# EAGLE design imu_logger (EAGLE 9.6.2)

## Sheet 1 of 3
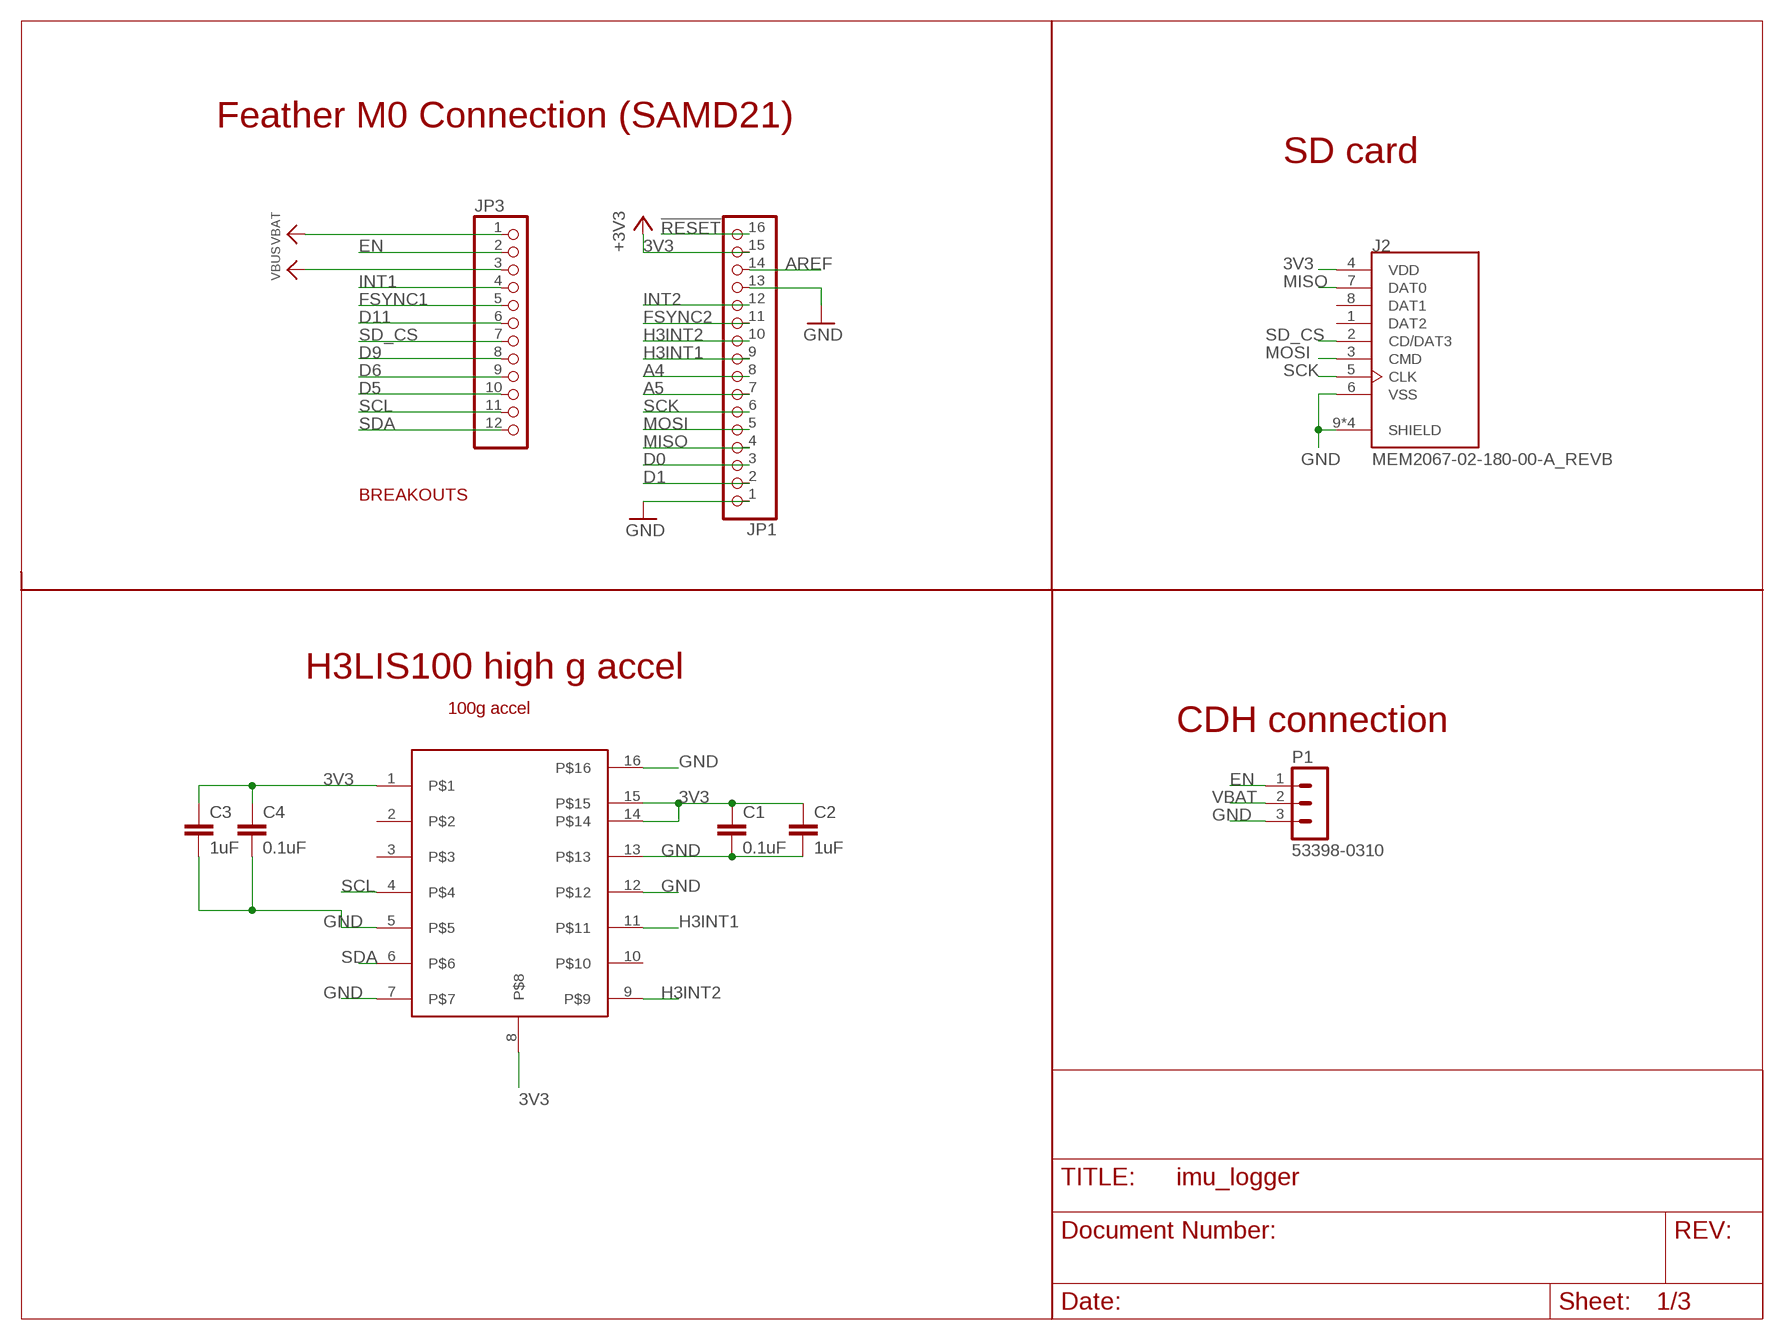
[diagram p0: schematic, sheet 1]

### Parts
C1  0.1uF  C-EUC0603  [C0603]
C2  1uF  C-EUC0603  [C0603]
C3  1uF  C-EUC0603  [C0603]
C4  0.1uF  C-EUC0603  [C0603]
J2  MEM2067-02-180-00-A_REVB  [GCT_MEM2067-02-180-00-A_REVB]
JP1  HEADER-1X16ROUND  [1X16_ROUND]
JP3  HEADER-1X12  [1X12_ROUND]
P1  53398-0310  [53398-0310]
U$1  H3LIS100DL  [XDCR_LIS3DHTR]

### Nets
3V3: C1.1 C2.1 C3.1 C4.1 J2.4(VDD) JP1.15 U$1.1 U$1.8 U$1.14 U$1.15 ; supply symbol labelled +3V3 ; also sheet 3
!RESET: JP1.16
A4: JP1.8
A5: JP1.7
AREF: JP1.14
D0: JP1.3
D1: JP1.2
D5: JP3.10
D6: JP3.9
D9: JP3.8
D11: JP3.6
EN: JP3.2 P1.1 ; also sheet 3
FSYNC1: JP3.5 ; also sheet 3
FSYNC2: JP1.11 ; also sheet 3
GND: C1.2 C2.2 C3.2 C4.2 J2.6(VSS) J2.9(SHIELD) J2.10(SHIELD) J2.11(SHIELD) J2.12(SHIELD) JP1.1 JP1.13 P1.3 U$1.5 U$1.7 U$1.12 U$1.13 U$1.16 ; also sheet 2,3
H3INT1: JP1.9 U$1.11
H3INT2: JP1.10 U$1.9
INT1: JP3.4 ; also sheet 3
INT2: JP1.12 ; also sheet 3
MISO: J2.7(DAT0) JP1.4
MOSI: J2.3(CMD) JP1.5
SCK: J2.5(CLK) JP1.6
SCL: JP3.11 U$1.4 ; also sheet 3
SD_CS: J2.2(CD/DAT3) JP3.7
SDA: JP3.12 U$1.6 ; also sheet 3
VBAT: JP3.1 P1.2 ; also sheet 3
VBUS: JP3.3
Unconnected: J2.1(DAT2) J2.8(DAT1) U$1.2 U$1.3 U$1.10

### Notes on the sheet
- Feather M0 Connection (SAMD21)
- SD card
- BREAKOUTS
- H3LIS100 high g accel
- 100g accel
- CDH connection

## Sheet 2 of 3
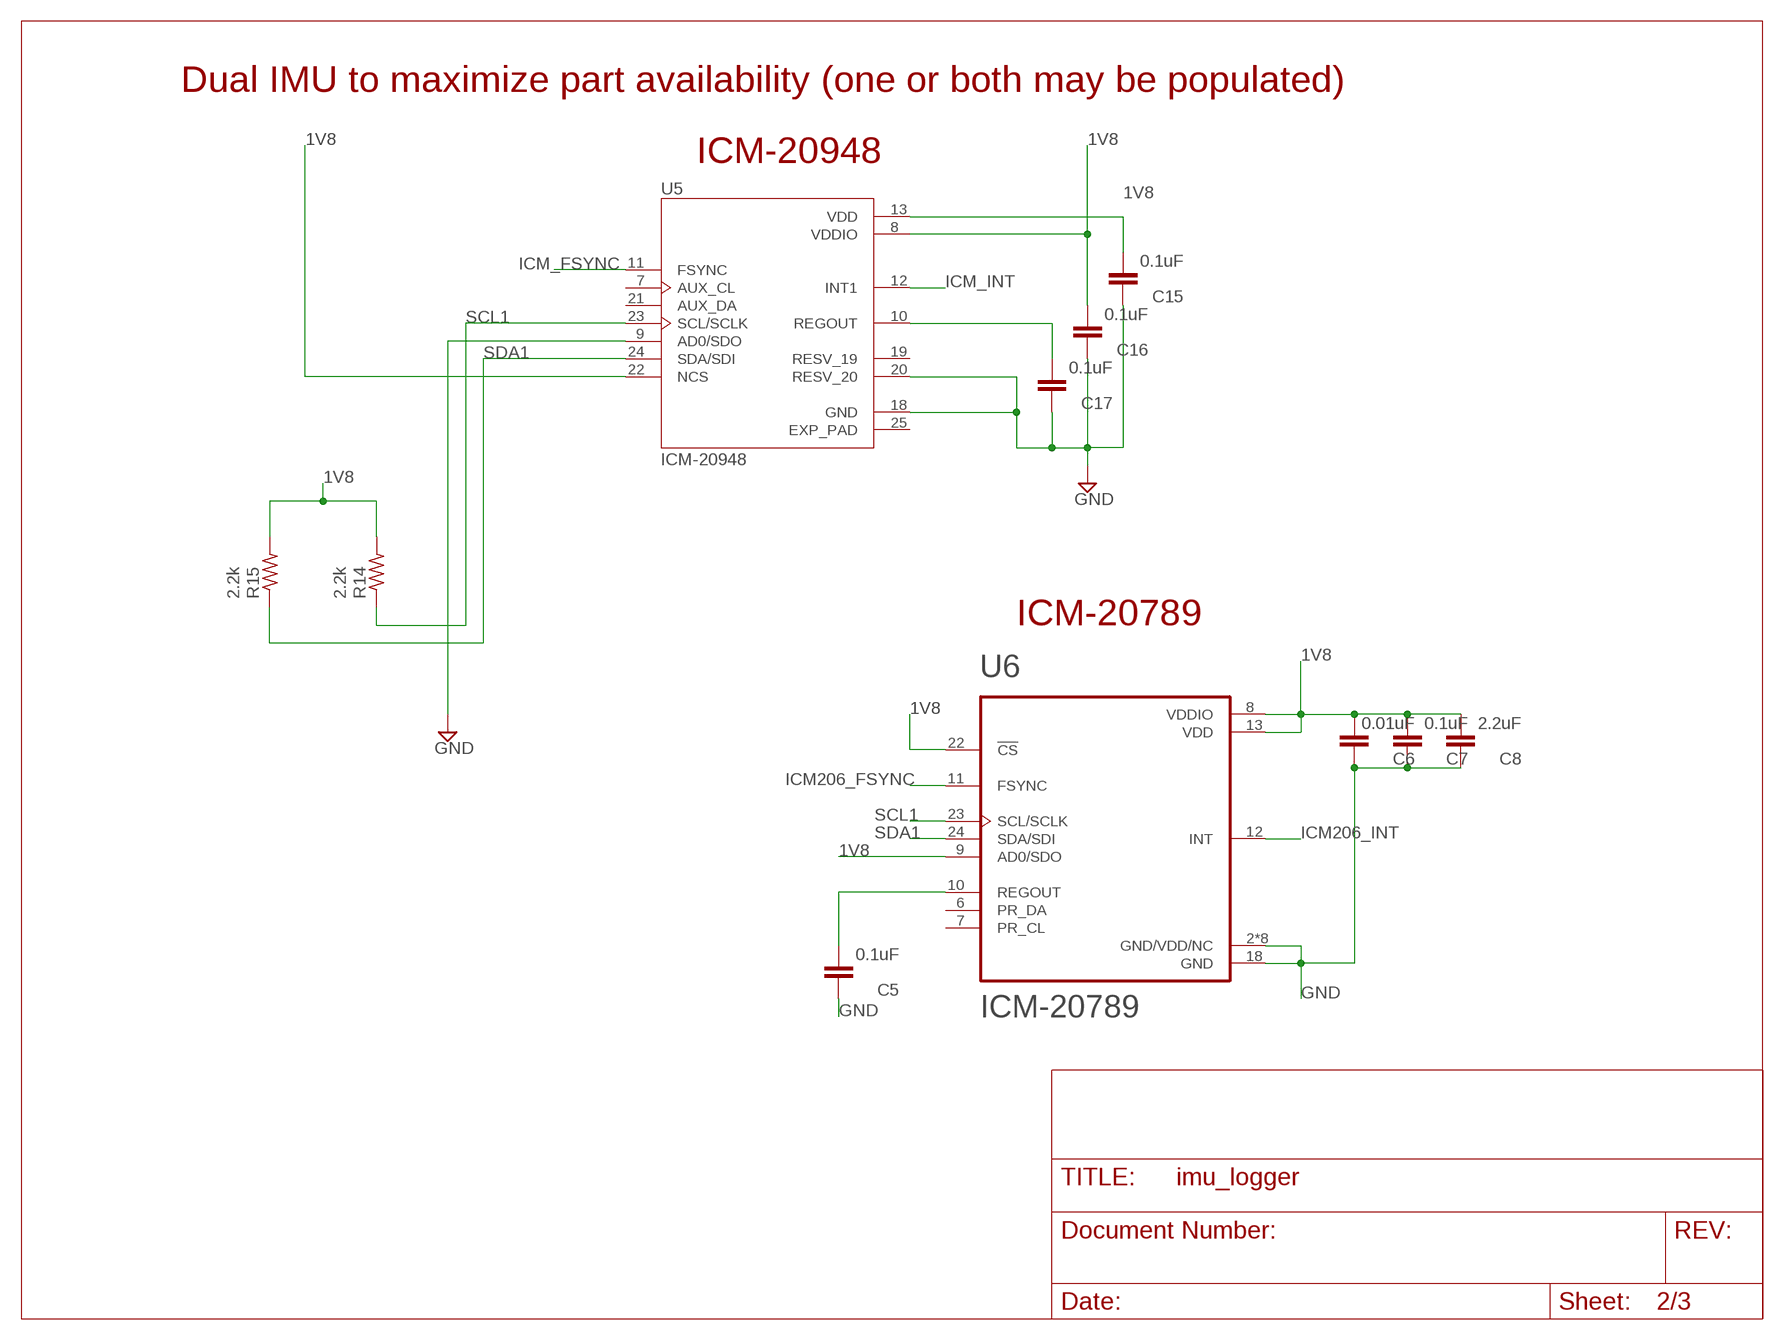
[diagram p1: schematic, sheet 2]

### Parts
C5  0.1uF  C-EUC0603  [C0603]
C6  0.01uF  C-EUC0603  [C0603]
C7  0.1uF  C-EUC0603  [C0603]
C8  2.2uF  C-EUC0603  [C0603]
C15  0.1uF  C-EUC0603  [C0603]
C16  0.1uF  C-EUC0603  [C0603]
C17  0.1uF  C-EUC0603  [C0603]
R14  2.2k  R-US_R0603  [R0603]
R15  2.2k  R-US_R0603  [R0603]
U5  ICM-20948  [QFN40P300X300X105-25N]
U6  ICM-20789  [PQFN50P400X400X146-24N]

### Nets
1V8: C6.2 C7.2 C8.2 C15.2 C16.2 R14.2 R15.2 U5.8(VDDIO) U5.13(VDD) U5.22(NCS) U6.8(VDDIO) U6.9(AD0/SDO) U6.13(VDD) U6.22(!CS) ; also sheet 3
GND: C5.1 C6.1 C7.1 C8.1 C15.1 C16.1 C17.1 U5.9(AD0/SDO) U5.18(GND) U5.20(RESV_20) U6.2(GND/VDD/NC) U6.3(GND/VDD/NC) U6.4(GND/VDD/NC) U6.5(GND/VDD/NC) U6.14(GND/VDD/NC) U6.15(GND/VDD/NC) U6.16(GND/VDD/NC) U6.17(GND/VDD/NC) U6.18(GND) ; also sheet 1,3
ICM206_FSYNC: U6.11(FSYNC) ; also sheet 3
ICM206_INT: U6.12(INT) ; also sheet 3
ICM_FSYNC: U5.11(FSYNC) ; also sheet 3
ICM_INT: U5.12(INT1) ; also sheet 3
N$4: C5.2 U6.10(REGOUT)
N$15: C17.2 U5.10(REGOUT)
SCL1: R14.1 U5.23(SCL/SCLK) U6.23(SCL/SCLK) ; also sheet 3
SDA1: R15.1 U5.24(SDA/SDI) U6.24(SDA/SDI) ; also sheet 3
Unconnected: U5.7(AUX_CL) U5.19(RESV_19) U5.21(AUX_DA) U6.6(PR_DA) U6.7(PR_CL)

### Notes on the sheet
- Dual IMU to maximize part availability (one or both may be populated)
- ICM-20948
- ICM-20789

## Sheet 3 of 3
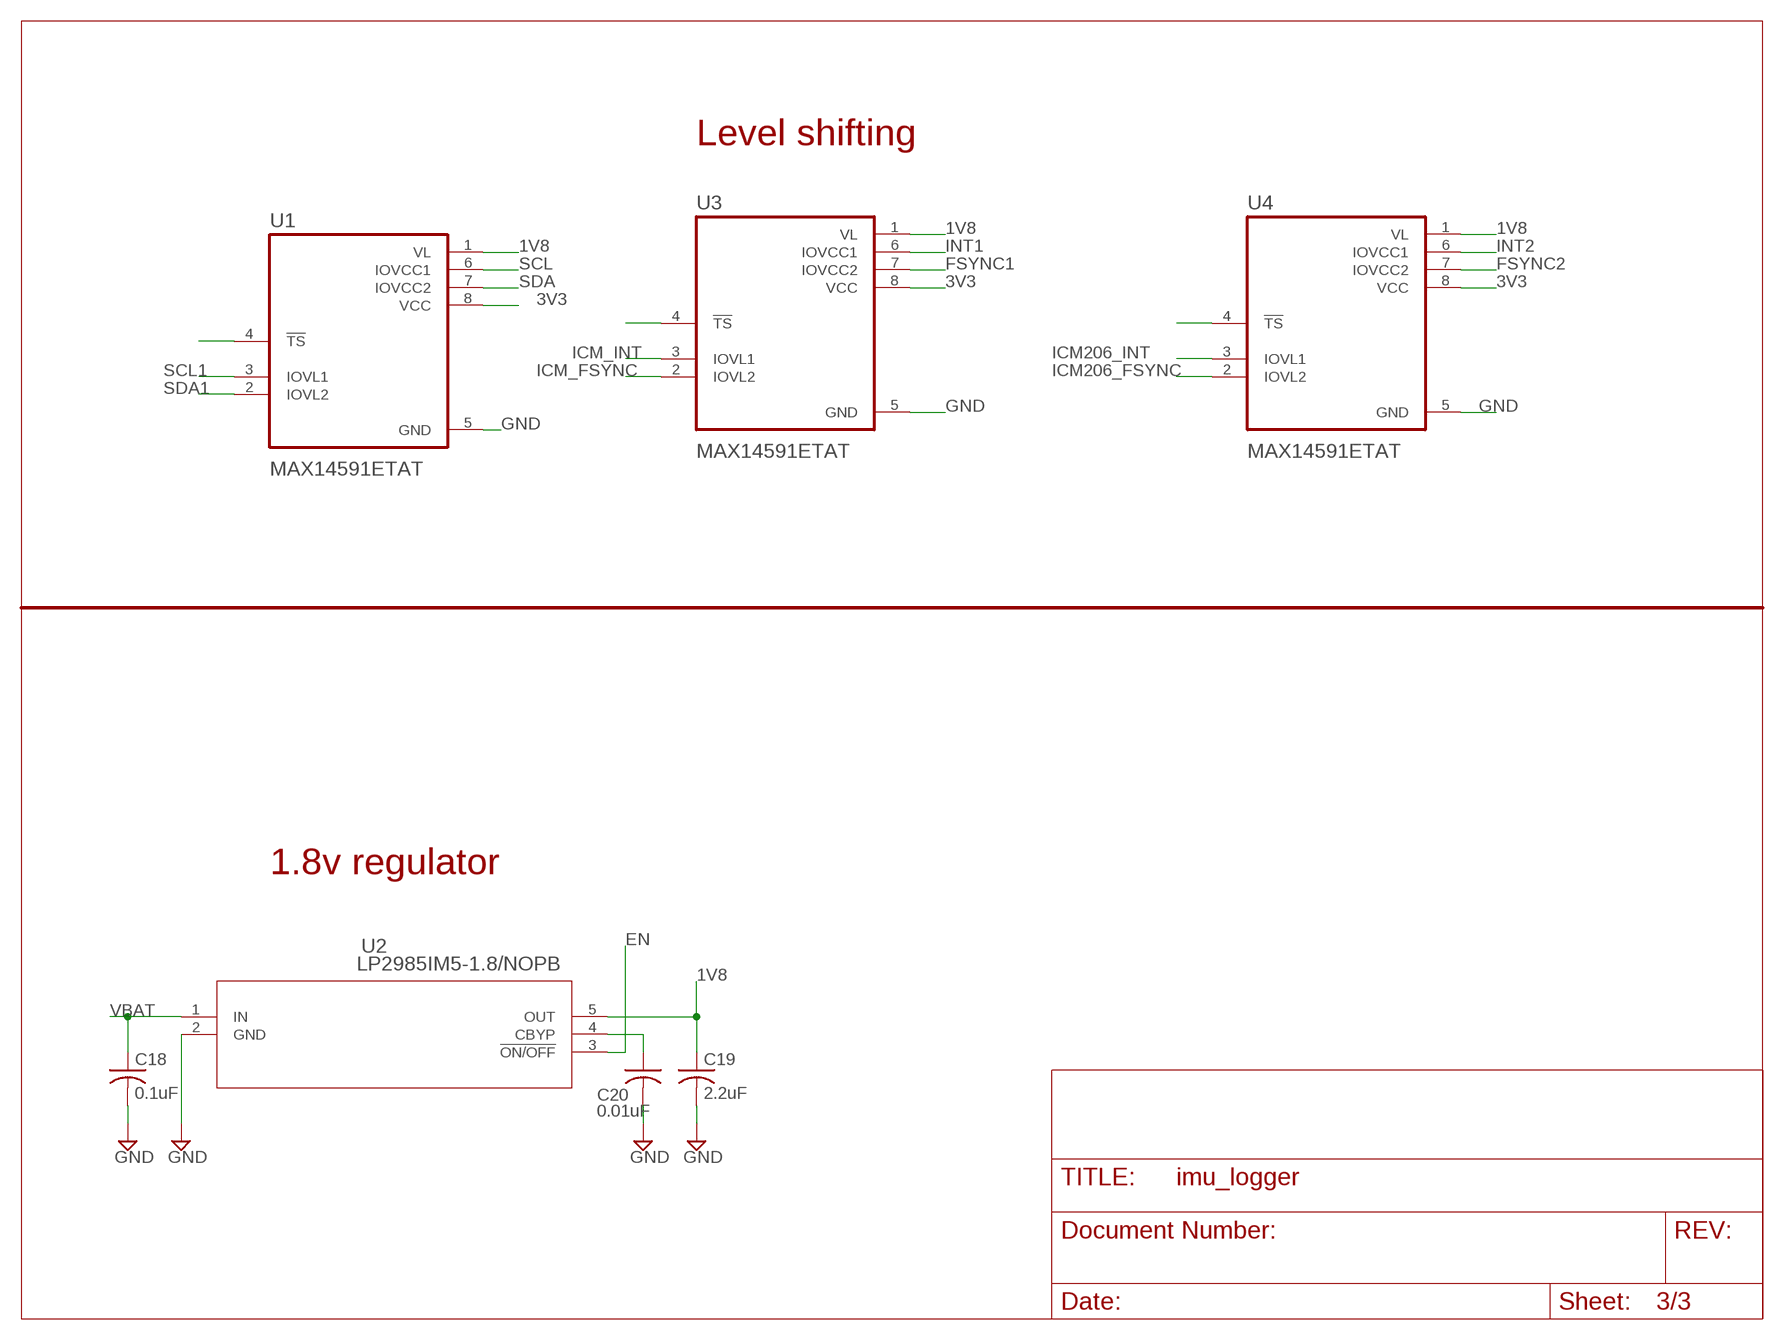
[diagram p2: schematic, sheet 3]

### Parts
C18  0.1uF  C-USC0603  [C0603]
C19  2.2uF  C-USC0603  [C0603]
C20  0.01uF  C-USC0603  [C0603]
U1  MAX14591ETAT  [SON50P200X200X80-8N]
U2  LP2985IM5-1.8/NOPB  [MF05A]
U3  MAX14591ETAT  [SON50P200X200X80-8N]
U4  MAX14591ETAT  [SON50P200X200X80-8N]

### Nets
1V8: C19.1 U1.1(VL) U2.5(OUT) U3.1(VL) U4.1(VL) ; also sheet 2
3V3: U1.8(VCC) U3.8(VCC) U4.8(VCC) ; also sheet 1
EN: U2.3(!ON/OFF) ; also sheet 1
FSYNC1: U3.7(IOVCC2) ; also sheet 1
FSYNC2: U4.7(IOVCC2) ; also sheet 1
GND: C18.2 C19.2 C20.2 U1.5(GND) U2.2(GND) U3.5(GND) U4.5(GND) ; also sheet 1,2
ICM206_FSYNC: U4.2(IOVL2) ; also sheet 2
ICM206_INT: U4.3(IOVL1) ; also sheet 2
ICM_FSYNC: U3.2(IOVL2) ; also sheet 2
ICM_INT: U3.3(IOVL1) ; also sheet 2
INT1: U3.6(IOVCC1) ; also sheet 1
INT2: U4.6(IOVCC1) ; also sheet 1
N$3: U4.4(!TS)
N$8: U1.4(!TS)
N$12: C20.1 U2.4(CBYP)
N$16: U3.4(!TS)
SCL: U1.6(IOVCC1) ; also sheet 1
SCL1: U1.3(IOVL1) ; also sheet 2
SDA: U1.7(IOVCC2) ; also sheet 1
SDA1: U1.2(IOVL2) ; also sheet 2
VBAT: C18.1 U2.1(IN) ; also sheet 1

### Notes on the sheet
- Level shifting
- 1.8v regulator

## Power pins joined to a net without a drawn wire
EXP_PAD: U5.25(EXP_PAD)

## Library data of the parts
C1-C8 C15-C17 = rcl:C-EU: CAPACITOR, European symbol; SPICEPREFIX: C
C18-C20 = rcl:C-US: CAPACITOR, American symbol; SPICEPREFIX: C
J2 = MEM20267:MEM2067-02-180-00-A_REVB: Micro SD Memory Card ConnectorSMT, Hinged, 1.80mm Profile Check prices <https://pricing.snapeda.com/parts/MEM2067-02-180-00-A/Global%20Connector%20Technology/view-part?ref=eda>; AVAILABILITY: In Stock; DESCRIPTION: 8 Position Card Connector microSD Surface Mount, Right Angle Gold; MF: Global Connector Technology; MP: MEM2067-02-180-00-A; PACKAGE: None; PRICE: None; PURCHASE-URL: https://pricing.snapeda.com/search/part/MEM2067-02-180-00-A/?ref=eda
JP1 = microbuilder:HEADER-1X16: PIN HEADER
JP3 = microbuilder:HEADER-1X12
P1 = con-molex-picoblade:53398-0310: HEADER
R14 R15 = rcl:R-US_: RESISTOR, American symbol; SPICEPREFIX: R
U1 U3 U4 = MAX14591ETAT:MAX14591ETAT; DESCRIPTION: Voltage Level Translator Bidirectional 1 Circuit 2 Channel 16Mbps 8-TDFN (2x2); DIGI-KEY_PART_NUMBER: MAX14591ETA+TCT-ND; MF: Maxim Integrated; MP: MAX14591ETA+T; PACKAGE: TDFN-8 Maxim; PURCHASE-URL: https://pricing.snapeda.com/search/part/MAX14591ETA+T/?ref=eda
U2 = gsynth:LP2985IM5-1.8/NOPB; MANUFACTURER_PART_NUMBER: LP2985IM51.8NOPB; VENDOR: Texas Instruments
U5 = ICM-20948:ICM-20948: Axis=3 Axis Gyro+3 Axis Accel+Compass. Pin For Pin With m; DESCRIPTION: 9 Axis=3 Axis Gyro+3 Axis Accel+Compass. Pin For Pin With m; DIGI-KEY_PART_NUMBER: 1428-1123-1-ND; DIGI-KEY_PURCHASE_URL: https://www.digikey.com/product-detail/en/tdk-invensense/ICM-20948/1428-1123-1-ND/7062698?utm_source=snapeda&utm_medium=aggregator&utm_campaign=symbol; MF: TDK InvenSense; MP: ICM-20948; PACKAGE: QFN-24 InvenSense
U6 = ICM-20789:ICM-20789: MOTION SENSOR IC; DESCRIPTION: Sensor I²C Output; DIGI-KEY_PART_NUMBER: 1428-1133-1-ND; MF: TDK InvenSense; MP: ICM-20789; PACKAGE: PQFN-24 TDK-InvenSense; PURCHASE-URL: https://pricing.snapeda.com/search/part/ICM-20789/?ref=eda
U$1 = LIS3DHTR:H3LIS100DL

## Net classes
2 gnd: width 0.254 mm

## Board
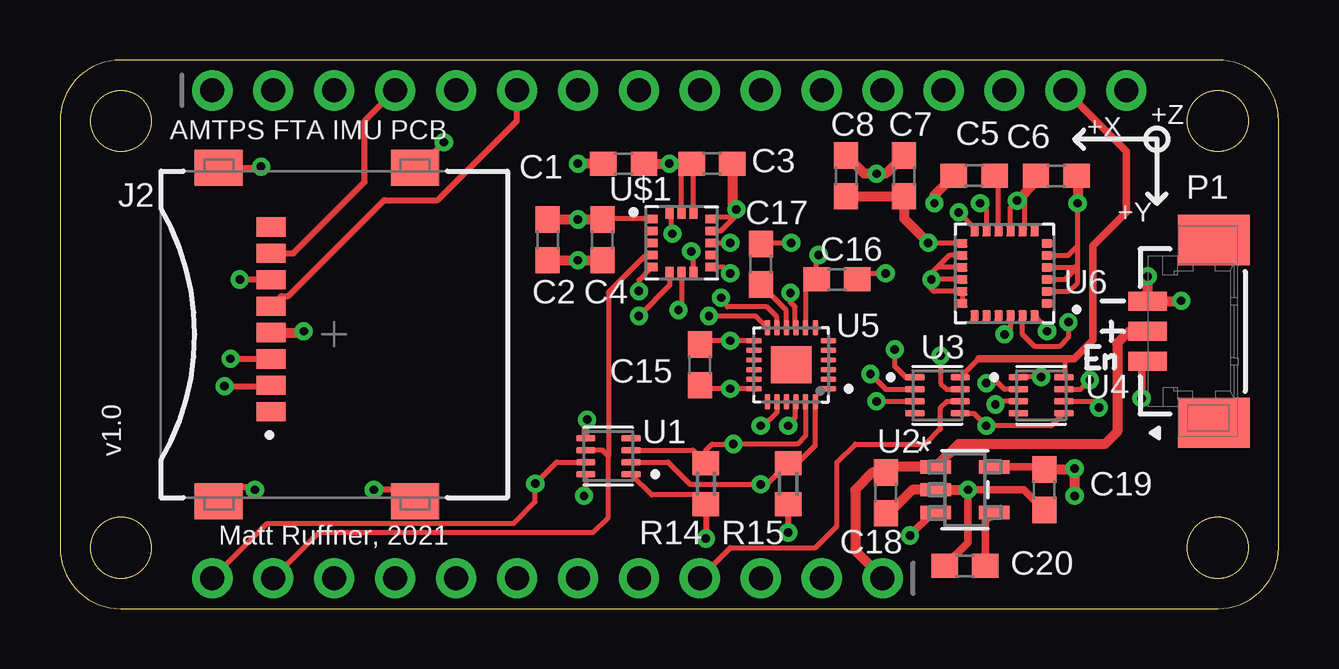
[diagram p3: board, top side]
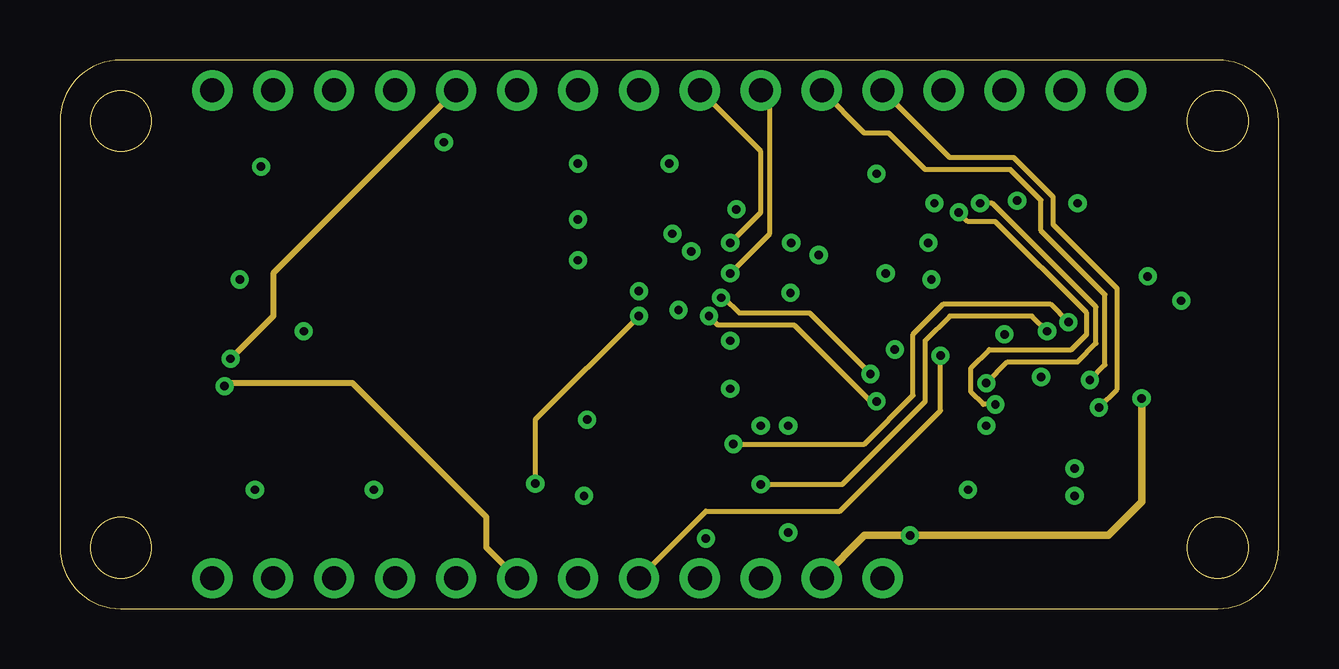
[diagram p4: board, inner layer Route2]
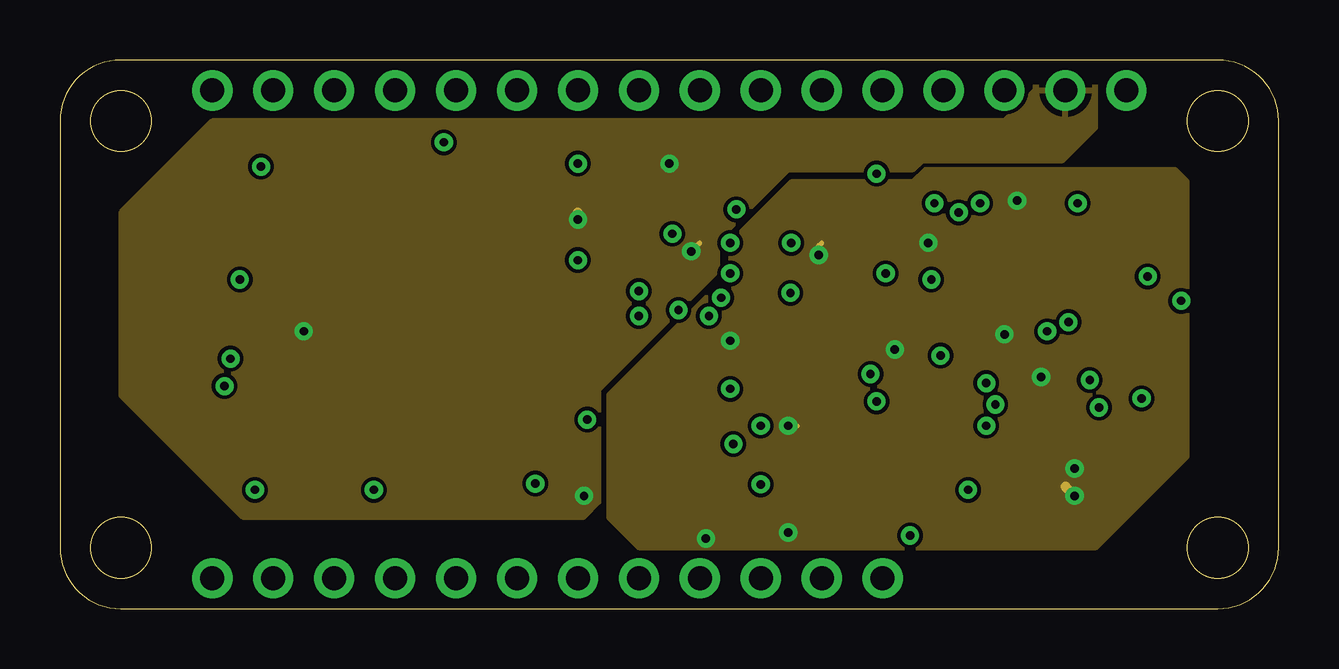
[diagram p5: board, inner layer Route15]
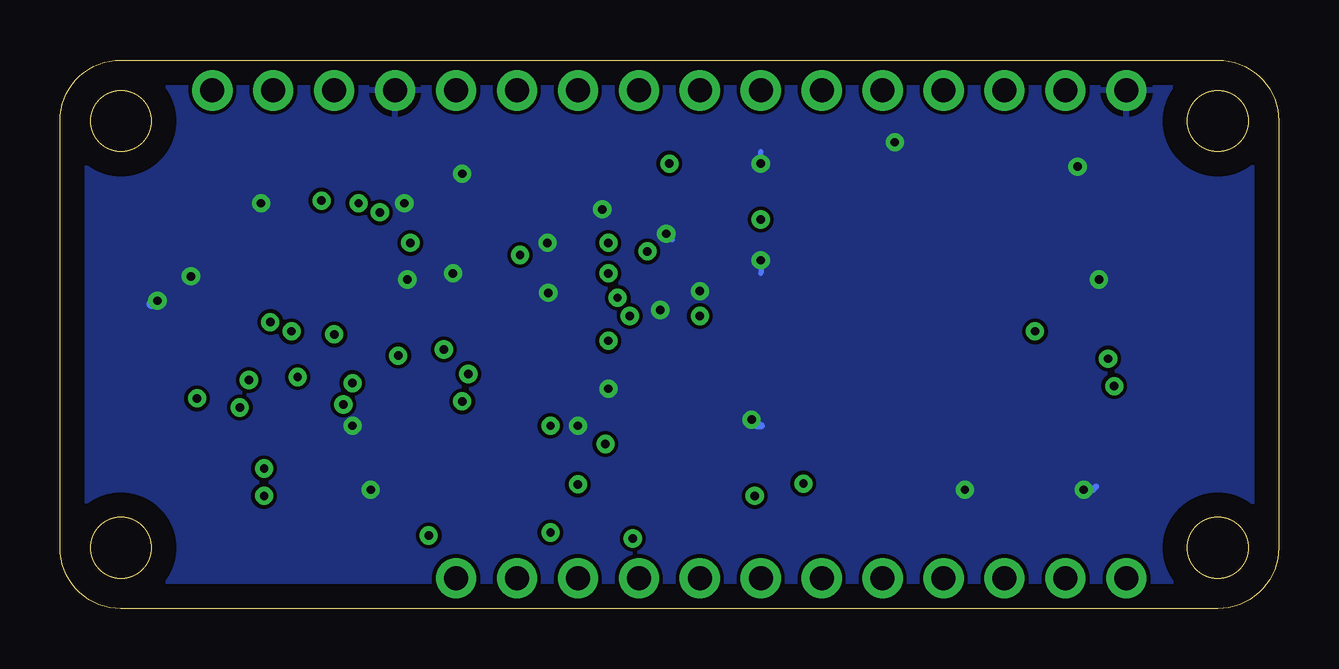
[diagram p6: board, bottom side, seen from below]

Size 50.8 x 22.86 mm. Coordinates in mm from the lower left corner, seen from the top.
Outline: 0,20.32 0,2.54 arc90 2.54,0 48.26,0 arc90 50.8,2.54 50.8,20.32 arc90 48.26,22.86 2.54,22.86 arc90 0,20.32
Outline: circle at 2.54,20.32 radius 1.27
Outline: circle at 2.54,2.54 radius 1.27
Outline: circle at 48.26,20.32 radius 1.27
Outline: circle at 48.26,2.54 radius 1.27
Copper layers (1+2*15+16): Top 0.035mm / dielectric 0.11mm / Route2 0.035mm / dielectric 1.13mm / Route15 0.035mm / dielectric 0.11mm / Bottom 0.035mm
Design rules "default *": minimum track width 6mil, minimum drill 0.35mm, track to track 6mil, track to pad 6mil, pad to pad 6mil, via to via 6mil, smd to smd 6mil, copper to edge 40mil, drill to drill 6mil, minimum pad ring 10mil, minimum via ring 8mil, stop-mask expansion 4mil, vias tented up to drill 14mil, thermal gap 10mil

### Footprints (pad centres in the part's own frame; a part is rotated, then mirrored left to right if it is on the bottom)
C0603 = smd 1.1 x 1: 1 -0.85,0; 2 0.85,0
GCT_MEM2067-02-180-00-A_REVB = smd 0.8 x 1.2: 1 3.225,-2.625; 2 2.125,-2.625; 3 1.025,-2.625; 4 -0.075,-2.625; 5 -1.175,-2.625; 6 -2.275,-2.625; 7 -3.375,-2.625; 8 -4.475,-2.625 | smd 1.5 x 2: 9 -6.945,-4.825; 10 -6.945,3.375; 11 6.945,3.375; 12 6.945,-4.825
1X16_ROUND = drill 1 pad 1.676: 1 -19.05,0; 2 -16.51,0; 3 -13.97,0; 4 -11.43,0; 5 -8.89,0; 6 -6.35,0; 7 -3.81,0; 8 -1.27,0; 9 1.27,0; 10 3.81,0; 11 6.35,0; 12 8.89,0; 13 11.43,0; 14 13.97,0; 15 16.51,0; 16 19.05,0
1X12_ROUND = drill 1 pad 1.676: 1 -13.97,0; 2 -11.43,0; 3 -8.89,0; 4 -6.35,0; 5 -3.81,0; 6 -1.27,0; 7 1.27,0; 8 3.81,0; 9 6.35,0; 10 8.89,0; 11 11.43,0; 12 13.97,0
53398-0310 = smd 0.8 x 1.6: 1 1.25,0; 2 0,0; 3 -1.25,0 | smd 2.1 x 3: M1 3.81,2.75; M2 -3.81,2.75
R0603 = smd 1 x 1.1: 1 -0.85,0; 2 0.85,0
SON50P200X200X80-8N = smd 0.81 x 0.27: 1 -0.945,0.75; 2 -0.945,0.25; 3 -0.945,-0.25; 4 -0.945,-0.75; 5 0.945,-0.75; 6 0.945,-0.25; 7 0.945,0.25; 8 0.945,0.75
MF05A = smd 1.27 x 0.559: 1 -1.219,0.953; 2 -1.219,0; 3 -1.219,-0.953; 4 1.219,-0.953; 5 1.219,0.953
QFN40P300X300X105-25N = smd 0.64 x 0.22: 1 -1.545,1; 2 -1.545,0.6; 3 -1.545,0.2; 4 -1.545,-0.2; 5 -1.545,-0.6; 6 -1.545,-1; 13 1.545,-1; 14 1.545,-0.6; 15 1.545,-0.2; 16 1.545,0.2; 17 1.545,0.6; 18 1.545,1 | smd 0.22 x 0.64: 7 -1,-1.545; 8 -0.6,-1.545; 9 -0.2,-1.545; 10 0.2,-1.545; 11 0.6,-1.545; 12 1,-1.545; 19 1,1.545; 20 0.6,1.545; 21 0.2,1.545; 22 -0.2,1.545; 23 -0.6,1.545; 24 -1,1.545 | smd 1.7 x 1.54: 25 0,0
PQFN50P400X400X146-24N = smd 0.45 x 0.35: 1 -1.765,1.25; 2 -1.765,0.75; 3 -1.765,0.25; 4 -1.765,-0.25; 5 -1.765,-0.75; 6 -1.765,-1.25; 13 1.765,-1.25; 14 1.765,-0.75; 15 1.765,-0.25; 16 1.765,0.25; 17 1.765,0.75; 18 1.765,1.25 | smd 0.35 x 0.45: 7 -1.25,-1.765; 8 -0.75,-1.765; 9 -0.25,-1.765; 10 0.25,-1.765; 11 0.75,-1.765; 12 1.25,-1.765; 19 1.25,1.765; 20 0.75,1.765; 21 0.25,1.765; 22 -0.25,1.765; 23 -0.75,1.765; 24 -1.25,1.765
XDCR_LIS3DHTR = smd 0.45 x 0.35: 1 -1.225,1; 2 -1.225,0.5; 3 -1.225,0; 4 -1.225,-0.5; 5 -1.225,-1; 9 1.225,-1; 10 1.225,-0.5; 11 1.225,0; 12 1.225,0.5; 13 1.225,1 | smd 0.35 x 0.45: 6 -0.5,-1.225; 7 0,-1.225; 8 0.5,-1.225; 14 0.5,1.225; 15 0,1.225; 16 -0.5,1.225

### Placement (x,y rotation side)
C1  23.5,18.54 180 top
C2  20.32,15.37 270 top
C3  27.18,18.54 0 top
C4  22.61,15.37 270 top
C5  38.1,18.03 0 top
C6  41.53,18.03 180 top
C7  35.18,18.03 270 top
C8  32.77,18.03 270 top
C15  26.67,10.16 90 top
C16  32.38,13.72 180 top
C17  29.21,14.35 270 top
C18  34.42,4.83 270 top
C19  41.02,4.95 270 top
C20  37.72,1.78 180 top
J2  11.43,11.43 270 top
JP1  25.4,21.59 0 top
JP3  20.32,1.27 180 top
P1  45.34,11.56 270 top
R14  26.92,5.21 270 top
R15  30.35,5.21 270 top
U1  22.86,6.35 180 top
U2  37.72,4.95 0 top
U3  36.58,8.89 0 top
U4  40.89,8.89 0 top
U5  30.48,10.16 180 top
U6  39.37,13.97 180 top
U$1  25.91,15.24 0 top

### Tracks (layer width: path | path; a pad name or v marks a point on that pad's centre or on a via)
1V8  (via drill 0.35)
  Top 0.203: U5.13 v27.94,11.16 26.82,11.16 C15.2 | U5.8 31.08,13.26 C16.2 31.54,14.64 v31.62,14.73 | U6.13 36.22,15.22 v36.2,15.24 | 40.19,17.29 40.19,15.81 U6.8 | U6.9 39.62,16.72 v39.9,17 40.19,17.29 | C6.2 40.68,17.78 40.19,17.29 | U1.1 24.67,4.74 26.54,4.74 R14.2 | U5.22 30.64,8.58 30.64,7.95 30.35,7.66 v30.35,7.62 | U3.1 35.25,9.64 34.8,10.09 v34.8,10.79 | U4.1 39.96,9.65 v40.89,9.65 | U6.22 39.62,11.69 39.62,11.68 v39.37,11.43
  Top 0.254: R14.2 v26.92,2.92 | R15.2 v30.35,3.17
  Top 0.305: U2.5 40.92,5.91 C19.1
  Top 0.406: C19.1 42.25,5.8 v42.29,5.84 v42.29,4.7 | C8.2 C7.2 35.18,16.26 v36.2,15.24 | 40.68,17.78 v39.9,17
  Route15 0.203: v30.35,7.62 30.73,7.62 | v31.62,14.73 31.62,15.11 31.75,15.24
  Route15 0.406: v42.29,4.7 41.91,5.08
  pour Route15: 46.48,18.29 36.07,18.29 35.56,17.78 30.48,17.78 27.94,15.24 27.94,13.97 22.86,8.89 22.86,3.81 24.13,2.54 43.18,2.54 46.99,6.35 46.99,17.78
3V3  (via drill 0.35)
  Top 0.203: U$1.14 26.41,18.46 C3.1 25.91,18.12 U$1.15 | U$1.1 22.63,16.24 C4.1 | U$1.8 26.41,14.61 26.23,14.8 v26.32,14.88 | U1.8 21.91,4.77 v21.84,4.7 | 38.3,10.41 U3.8 | U4.8 41.91,9.71 41.91,10.41
  Top 0.305: JP1.15 44.45,19.05 44.45,16.51 43.05,15.11 43.05,11.18 42.29,10.41 41.91,10.41 38.3,10.41
  Top 0.406: C2.1 v21.59,16.22 C4.1 | C1.1 v25.4,18.54 C3.1 | J2.4 10.11,11.51 v10.16,11.56
  Route15 0.203: v26.32,14.88 26.67,15.24
  Route15 0.406: v21.59,16.22 21.59,16.51
  pour Route15: 40.64,22.86 40.64,21.59 39.37,20.32 6.35,20.32 2.54,16.51 2.54,8.89 7.62,3.81 21.84,3.81 22.48,4.45 22.48,9.14 27.43,14.1 27.43,15.37 30.35,18.29 35.56,18.29 35.94,18.67 41.78,18.67 43.18,20.07 43.18,22.86
EN  (via drill 0.35)
  Top 0.305: U2.3 36.39,4 v35.43,3.05 | v45.09,8.76 45.09,10.05 P1.1
  Route2 0.305: JP3.2 33.53,3.05 v35.43,3.05 43.69,3.05 45.09,4.45 v45.09,8.76
FSYNC1  (via drill 0.35)
  Top 0.203: v36.7,10.54 36.7,9.4 36.96,9.14 U3.7
  Route2 0.203: JP3.5 26.92,4.06 32.51,4.06 36.7,8.26 v36.7,10.54
FSYNC2  (via drill 0.35)
  Top 0.203: U4.7 42.54,9.14 v42.93,9.53
  Route2 0.203: v42.93,9.53 43.56,10.16 43.56,13.08 40.89,15.75 40.89,17.02 39.62,18.29 36.07,18.29 34.54,19.81 33.53,19.81 JP1.11
GND  (via drill 0.35)
  Top 0.203: U$1.7 25.91,12.57 v25.78,12.45 | U$1.12 27.55,15.74 28.13,16.32 | v28.19,16.64 28.19,16.51 28.19,16.38 28.13,16.32 | U$1.13 27.21,16.32 28.13,16.32 | U$1.16 25.48,16.39 25.48,15.88 25.53,15.83 v25.53,15.62 | U5.18 v27.94,9.16 26.82,9.16 C15.1 | C17.1 29.25,15.24 v30.48,15.24 | U5.9 30.64,11.74 30.64,12.57 30.45,12.77 v30.45,13.16 | C16.1 33.49,13.97 v34.42,13.97 | U$1.5 24.13,13.69 v24.13,13.23 | U5.20 29.88,8.17 29.33,7.62 v29.21,7.62 | U3.5 38.09,8.14 v38.61,7.62 41.32,7.62 U4.5 | U6.14 37.07,14.72 36.58,14.22 | 36.2,13.59 36.2,13.84 36.58,14.22 | 36.2,13.59 36.2,13.46 36.45,13.21 36.46,13.22 U6.17 U6.18 | U6.16 v36.33,13.72 v36.32,13.72 36.2,13.59 | U6.15 36.58,14.22 | U6.5 42.02,14.72 42.42,15.11 | 42.42,15.11 v42.42,16.89 | U6.4 42.29,14.22 | 42.29,14.22 42.41,14.22 41.91,13.72 U6.3 | 42.42,14.35 42.42,15.11 | 42.29,14.22 42.42,14.35 | U6.2 42.05,13.22 42.42,13.59 42.42,14.35
  Top 0.254: J2.6 7.5,13.71 v7.49,13.72 | J2.9 8.34,18.38 v8.38,18.41 | J2.10 14.95,18.38 v16,19.43 | J2.11 14.34,4.95 v13.08,4.95 | J2.12 7.2,5.08 8,5.08 v8.13,4.95
  Top 0.305: U1.5 21.91,7.82 v21.97,7.87 | C19.2 40.17,4.95 v37.85,4.95 37.85,2.75 C20.2
  Top 0.406: v37.85,4.95 U2.2 35.52,4.95 34.54,3.98 C18.2 | C1.2 v21.59,18.54 | C2.2 v21.59,14.52 C4.2 | v45.34,13.84 P1.3 46.72,12.81 v46.74,12.83 | C5.1 36.45,17.23 v36.45,16.89 | C6.1 42.42,18 v42.42,16.89 | C8.1 33.53,18.12 v34.04,18.12 34.42,18.12 C7.1 | C3.2 28.03,16.68 28.19,16.51
  Bottom 0.203: v21.59,18.54 21.59,19.05 | v28.19,16.64 28.07,16.51 27.94,16.51 | v25.53,15.62 25.27,15.37 | v21.59,14.52 21.59,13.97
  Bottom 0.254: v8.13,4.95 7.75,4.95 7.62,5.08
  Bottom 0.305: v21.97,7.87 21.72,7.62 21.59,7.62
  Bottom 0.406: v46.74,12.83 46.86,12.83 46.99,12.7
  pour Bottom: 0,24.13 52.07,24.13 52.07,0 50.8,-1.27 0,-1.27 -1.27,0 -1.27,22.86
H3INT1  (via drill 0.35)
  Top 0.203: U$1.11 v27.94,15.24
  Route2 0.203: v27.94,15.24 29.21,16.51 29.21,19.05 JP1.9
H3INT2  (via drill 0.35)
  Top 0.203: U$1.9 27.67,14.24 v27.94,13.97
  Route2 0.203: v27.94,13.97 29.59,15.62 29.59,21.21 JP1.10
ICM206_FSYNC  (via drill 0.35)
  Top 0.203: U4.2 39.37,9.14 39.12,9.4 v38.61,9.4 | v38.35,16.89 38.62,16.62 U6.11
  Route2 0.203: v38.61,9.4 39.5,10.29 42.42,10.29 43.18,11.05 43.18,12.57 38.86,16.89 v38.35,16.89
ICM206_INT  (via drill 0.35)
  Top 0.203: U4.3 39.12,8.64 v38.99,8.51 | v37.47,16.51 38.12,15.86 U6.12
  Route2 0.203: v38.99,8.51 38.48,8.51 37.97,9.02 37.97,10.03 38.73,10.79 42.16,10.79 42.8,11.43 42.8,12.32 38.99,16.13 37.85,16.13 v37.47,16.51
ICM_FSYNC  (via drill 0.35)
  Top 0.203: U5.11 29.88,12.16 29.46,12.57 27.81,12.57 27.56,12.83 v27.56,12.95 | v33.78,9.78 34.42,9.14 U3.2
  Route2 0.203: v27.56,12.95 27.69,12.95 28.32,12.32 31.24,12.32 v33.78,9.78
ICM_INT  (via drill 0.35)
  Top 0.203: U5.12 28.99,12.19 v27.05,12.19 | v34.04,8.64 U3.3
  Route2 0.203: v27.05,12.19 27.43,11.81 30.61,11.81 33.78,8.64 v34.04,8.64
INT1
  Top 0.203: JP3.4 27.94,2.54 31.5,2.54 32.38,3.43 32.38,6.1 33.15,6.86 36.07,6.86 36.7,7.49 36.7,8.38 36.96,8.64 U3.6
INT2  (via drill 0.35)
  Top 0.203: U4.6 43.05,8.64 v43.31,8.38
  Route2 0.203: v43.31,8.38 44.07,9.14 44.07,13.34 41.4,16 41.4,17.14 39.75,18.8 37.08,18.8 JP1.12
MISO
  Top 0.254: J2.7 9.72,14.8 12.7,17.78 12.7,20.32 JP1.4
MOSI  (via drill 0.35)
  Top 0.254: v7.11,10.41 8.8,10.41 J2.3
  Route2 0.254: JP1.5 8.89,13.97 8.89,12.19 v7.11,10.41
N$4
  Top 0.203: U6.10 39.12,17.86 C5.2
N$12
  Top 0.305: U2.4 38.57,3.63 C20.1
N$15
  Top 0.203: U5.10 30.28,12.43 C17.2
SCK
  Top 0.254: J2.5 9.23,13.03 9.52,13.03 13.51,17.02 15.75,17.02 19.05,20.32 JP1.6
SCL
  Top 0.203: JP3.11 10.79,3.17 22.23,3.17 22.86,3.81 22.86,6.35 | 22.86,6.35 22.61,6.6 U1.6 | U$1.4 24.61,14.67 24.35,14.67 22.86,13.18 22.86,6.35
SCL1  (via drill 0.35)
  Top 0.203: U1.3 26.38,6.6 R14.1 26.92,6.6 27.18,6.86 v28.07,6.86 30.73,6.86 31.08,7.2 U5.23 | v42.04,11.94 42.04,11.3 41.66,10.92 40.64,10.92 40.12,11.44 U6.23
  Route2 0.203: v28.07,6.86 33.53,6.86 35.56,8.89 35.56,11.43 36.83,12.7 41.27,12.7 v42.04,11.94
SD_CS  (via drill 0.35)
  Top 0.254: 6.8,9.33 v6.86,9.27 8.77,9.27 J2.2
  Route2 0.254: JP3.7 17.78,2.54 17.78,3.81 12.19,9.4 6.99,9.4 v6.86,9.27
SDA  (via drill 0.35)
  Top 0.203: JP3.12 8.64,3.56 18.92,3.56 19.81,4.45 v19.81,5.21 20.7,6.1 U1.7 | U$1.6 25.41,13.47 v24.13,12.19
  Route2 0.203: v24.13,12.19 19.81,7.87 v19.81,5.21
SDA1  (via drill 0.35)
  Top 0.203: U1.2 25.34,6.1 26.27,5.18 v29.21,5.18 29.47,5.18 R15.1 30.73,6.06 31.48,6.8 U5.24 | v41.15,11.56 41.15,11.68 U6.24
  Route2 0.203: v29.21,5.18 32.61,5.18 36.07,8.64 36.07,11.18 37.08,12.19 40.51,12.19 v41.15,11.56
VBAT
  Top 0.406: JP3.1 33.15,2.41 33.15,4.95 33.87,5.68 C18.1 34.65,5.91 U2.1 37.45,6.86 43.56,6.86 44.07,7.37 44.07,11.05 44.58,11.56 P1.2

### Text on the board
tNames: AMTPS FTA IMU PCB | +X | +Z | +Y | v1.0 | Matt Ruffner, 2021